# Altium schematic sheet HOL-Nova.SchDoc: Hologram Nova 1.0
size B; Date: 4/19/2017; Revision: J; SheetNumber: 1; SheetTotal: 1
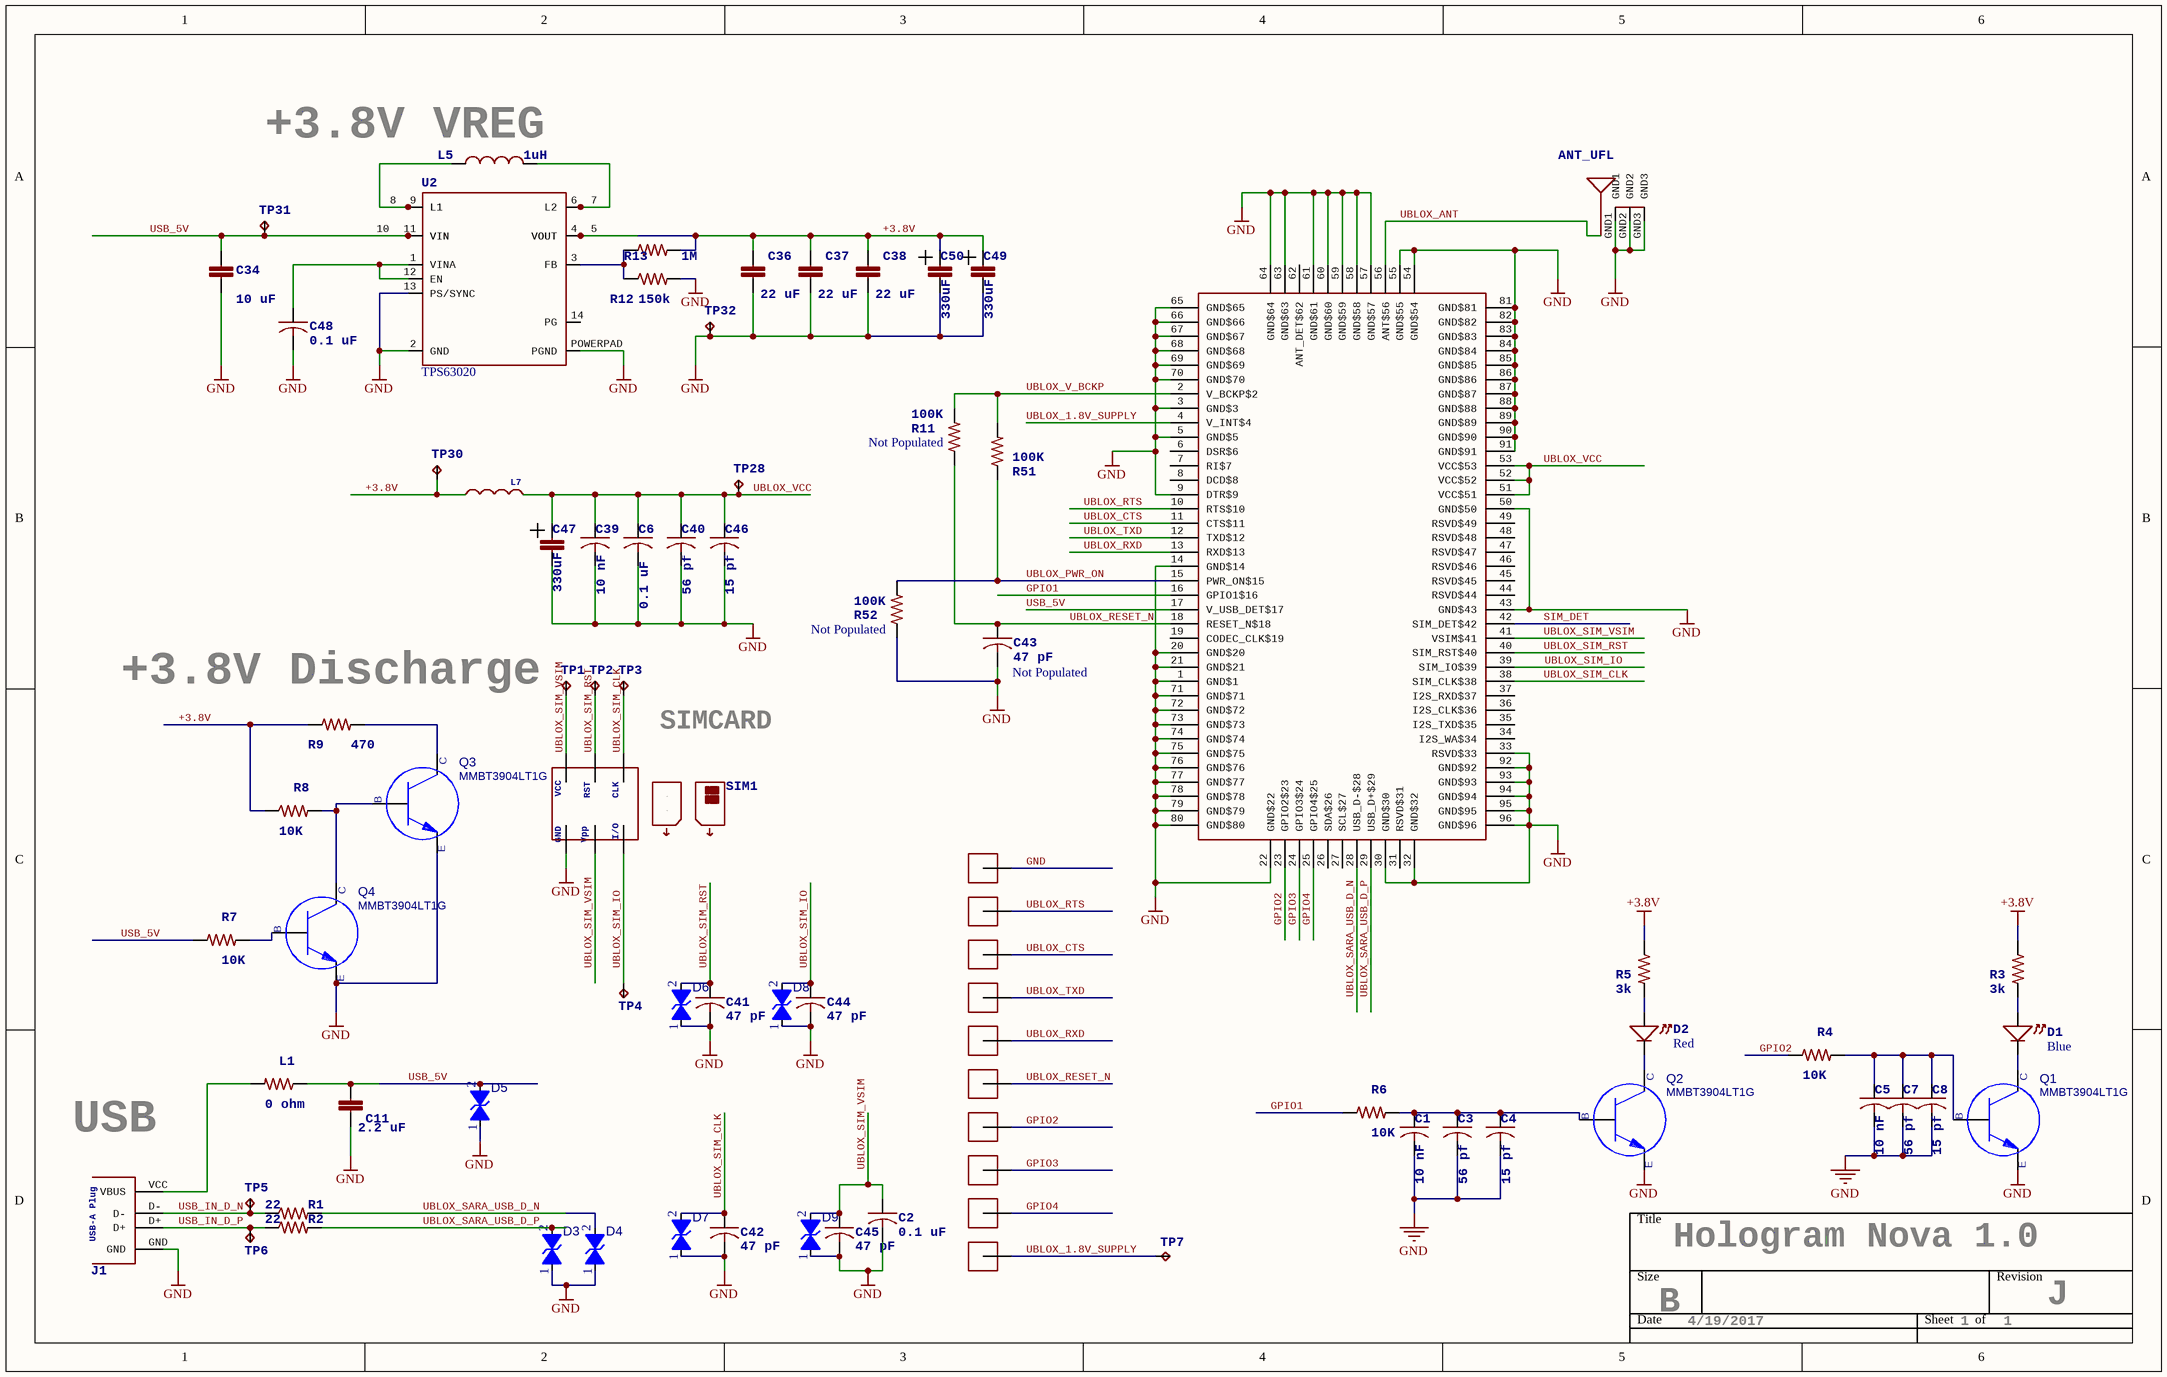
[diagram p0: HOL-Nova.SchDoc]

## Parts
ANT_UFL  ANT-A-1JB  [UFL]  (value not drawn)
C1  10 nF  [CAP0402]
C2  0.1 uF  [CAP0402]
C3  56 pf  [CAP0402]
C4  15 pf  [CAP0402]
C5  10 nF  [CAP0402]
C6  0.1 uF  [CAP0402]
C7  56 pf  [CAP0402]
C8  15 pf  [CAP0402]
C11  2.2 uF  [CAP0603]
C34  10 uF  [CAP0603]
C36  22 uF  [CAP0603]
C37  22 uF  [CAP0603]
C38  22 uF  [CAP0603]
C39  10 nF  [CAP0402]
C40  56 pf  [CAP0402]
C41  47 pF  [CAP0402]
C42  47 pF  [CAP0402]
C43  47 pF  NP: Not Populated  [CAP0402]  (no BOM)
C44  47 pF  [CAP0402]
C45  47 pF  [CAP0402]
C46  15 pf  [CAP0402]
C47  330uF  [CAP1210POL]
C48  0.1 uF  [CAP0402]
C49  330uF  [CAP1210POL]
C50  330uF  [CAP1210POL]
D1  Color: Blue  [LED_0402_VISHAY_VLMB]  (hidden comment: LED_0402_VLMB)
D2  Color: Red  [LED_0402_VISHAY_VLMS]  (hidden comment: LED_0402_VLMS)
D3  (no value)  [PESD_0402]
D4  (no value)  [PESD_0402]
D5  (no value)  [PESD_0402]
D6  (no value)  [PESD_0402]
D7  (no value)  [PESD_0402]
D8  (no value)  [PESD_0402]
D9  (no value)  [PESD_0402]
J1  USB-A: USB-A Plug  [USB_A_PLUG_MOLEX_0480372200 - clipped_copper]  (hidden comment: USB_A_PLUG_MOLEX_0480372200)
L1  0 ohm  [RES0603]
L5  1uH  [COILCRAFT_XFL4020]
L7  FerriteBead 120ohm, 3A  [RES0603]  (value not drawn)
Q1  MPN: MMBT3904LT1G  [SOT23]
Q2  MPN: MMBT3904LT1G  [SOT23]
Q3  MPN: MMBT3904LT1G  [SOT23]
Q4  MPN: MMBT3904LT1G  [SOT23]
R1  22  [RES0402]
R2  22  [RES0402]
R3  3k  [RES0402]
R4  10K  [RES0402]
R5  3k  [RES0402]
R6  10K  [RES0402]
R7  10K  [RES0402]
R8  10K  [RES0402]
R9  470  [RES0402]
R11  100K  NP: Not Populated  [RES0402]  (no BOM)
R12  150k  [RES0402]
R13  1M  [RES0402]
R51  100K  [RES0402]
R52  100K  NP: Not Populated  [RES0402]  (no BOM)
SIM1  SIM_CARD_NANO  [SIM_CARD_NANO]  (value not drawn)
T1  TESTPAD  [TESTPAD]  (value not drawn)  (no BOM)
T2  TESTPAD  [TESTPAD]  (value not drawn)  (no BOM)
T3  TESTPAD  [TESTPAD]  (value not drawn)  (no BOM)
T4  TESTPAD  [TESTPAD]  (value not drawn)  (no BOM)
T5  TESTPAD  [TESTPAD]  (value not drawn)  (no BOM)
T6  TESTPAD  [TESTPAD]  (value not drawn)  (no BOM)
T7  TESTPAD  [TESTPAD]  (value not drawn)  (no BOM)
T8  TESTPAD  [TESTPAD]  (value not drawn)  (no BOM)
T9  TESTPAD  [TESTPAD]  (value not drawn)  (no BOM)
T10  TESTPAD  [TESTPAD]  (value not drawn)  (no BOM)
TP1  TPTP08R  [TP08R]  (value not drawn)  (no BOM)
TP2  TPTP08R  [TP08R]  (value not drawn)  (no BOM)
TP3  TPTP08R  [TP08R]  (value not drawn)  (no BOM)
TP4  TPTP08R  [TP08R]  (value not drawn)  (no BOM)
TP5  TPTP08R  [TP08R]  (value not drawn)  (no BOM)
TP6  TPTP08R  [TP08R]  (value not drawn)  (no BOM)
TP7  TPTP08R  [TP08R]  (value not drawn)  (no BOM)
TP28  TPTP08R  [TP08R]  (value not drawn)  (no BOM)
TP30  TPTP08R  [TP08R]  (value not drawn)  (no BOM)
TP31  TPTP08R  [TP08R]  (value not drawn)  (no BOM)
TP32  TPTP08R  [TP08R]  (value not drawn)  (no BOM)
U2  TPS63020  [QFN-14-POWERPAD3X4DSJ]
U16  SARA-U2XX  [SARA]  (value not drawn)

## Nets
+3.8V: C36.1 C37.1 C38.1 C49.1 C50.1 L7.2(P$2) R3.1 R5.1 R8.1 R9.1 R13.2 TP30.TP U2.4(VOUT) U2.5(VOUT)
GND: ANT_UFL.GND1 ANT_UFL.GND2 ANT_UFL.GND3 C1.2 C2.2 C3.2 C4.2 C5.2 C6.2 C7.2 C8.2 C11.2 C34.2 C36.2 C37.2 C38.2 C39.2 C40.2 C41.2 C42.2 C43.2 C44.2 C45.2 C46.2 C47.2 C48.2 C49.2 C50.2 D3.1 D4.1 D5.1 D6.1 D7.1 D8.1 D9.1 J1.GND Q1.2(E) Q2.2(E) Q3.2(E) Q4.2(E) R12.2 R52.1 SIM1.C5(GND) T10.P$1 TP32.TP U2.2(GND) U2.13(PS/SYNC) U2.POWERPAD(PGND) U16.1(GND$1) U16.3(GND$3) U16.5(GND$5) U16.9(DTR$9) U16.14(GND$14) U16.20(GND$20) U16.21(GND$21) U16.22(GND$22) U16.30(GND$30) U16.32(GND$32) U16.33(RSVD$33) U16.43(GND$43) U16.50(GND$50) U16.54(GND$54) U16.55(GND$55) U16.57(GND$57) U16.58(GND$58) U16.59(GND$59) U16.60(GND$60) U16.61(GND$61) U16.63(GND$63) U16.64(GND$64) U16.65(GND$65) U16.66(GND$66) U16.67(GND$67) U16.68(GND$68) U16.69(GND$69) U16.70(GND$70) U16.71(GND$71) U16.72(GND$72) U16.73(GND$73) U16.74(GND$74) U16.75(GND$75) U16.76(GND$76) U16.77(GND$77) U16.78(GND$78) U16.79(GND$79) U16.80(GND$80) U16.81(GND$81) U16.82(GND$82) U16.83(GND$83) U16.84(GND$84) U16.85(GND$85) U16.86(GND$86) U16.87(GND$87) U16.88(GND$88) U16.89(GND$89) U16.90(GND$90) U16.91(GND$91) U16.92(GND$92) U16.93(GND$93) U16.94(GND$94) U16.95(GND$95) U16.96(GND$96)
GPIO1: R6.1 U16.16(GPIO1$16)
GPIO2: R4.1 T6.P$1 U16.23(GPIO2$23)
GPIO3: T7.P$1 U16.24(GPIO3$24)
GPIO4: T8.P$1 U16.25(GPIO4$25)
SIM_DET: U16.42(SIM_DET$42)
UBLOX_1.8V_SUPPLY: T9.P$1 TP7.TP U16.4(V_INT$4)
UBLOX_ANT: ANT_UFL.SIGNAL U16.56(ANT$56)
UBLOX_CTS: T2.P$1 U16.11(CTS$11)
UBLOX_PWR_ON: R51.1 R52.2 U16.15(PWR_ON$15)
UBLOX_RESET_N: C43.1 R11.1 T5.P$1 U16.18(RESET_N$18)
UBLOX_RTS: T1.P$1 U16.10(RTS$10)
UBLOX_RXD: T4.P$1 U16.13(RXD$13)
UBLOX_SARA_USB_D_N: D4.2 R1.2 U16.28(USB_D-$28)
UBLOX_SARA_USB_D_P: D3.2 R2.2 U16.29(USB_D+$29)
UBLOX_SIM_CLK: C42.1 D7.2 SIM1.C3(CLK) TP3.TP U16.38(SIM_CLK$38)
UBLOX_SIM_IO: C44.1 D8.2 SIM1.C7(IO) TP4.TP U16.39(SIM_IO$39)
UBLOX_SIM_RST: C41.1 D6.2 SIM1.C2(RST) TP2.TP U16.40(SIM_RST$40)
UBLOX_SIM_VSIM: C2.1 C45.1 D9.2 SIM1.C1(VCC) SIM1.C6(VCC2) TP1.TP U16.41(VSIM$41)
UBLOX_TXD: T3.P$1 U16.12(TXD$12)
UBLOX_V_BCKP: R11.2 R51.2 U16.2(V_BCKP$2)
UBLOX_VCC: C6.1 C39.1 C40.1 C46.1 C47.1 L7.1(P$1) TP28.TP U16.51(VCC$51) U16.52(VCC$52) U16.53(VCC$53)
USB_5V: C11.1 C34.1 D5.2 L1.1 R7.1 TP31.TP U2.10(VIN) U2.11(VIN) U16.17(V_USB_DET$17)
USB_IN_D_N: J1.D- R1.1 TP5.TP
USB_IN_D_P: J1.D+ R2.1 TP6.TP
NetC1_1: C1.1 C3.1 C4.1 Q2.1(B) R6.2
NetC5_1: C5.1 C7.1 C8.1 Q1.1(B) R4.2
NetC48_1: C48.1 U2.1(VINA) U2.12(EN)
NetD1_ANODE: D1.ANODE R3.2
NetD1_CATHODE: D1.CATHODE Q1.3(C)
NetD2_ANODE: D2.ANODE R5.2
NetD2_CATHODE: D2.CATHODE Q2.3(C)
NetJ1_VCC: J1.VCC(VBUS) L1.2
NetL5_P$1: L5.P$1 U2.8(L1) U2.9(L1)
NetL5_P$2: L5.P$2 U2.6(L2) U2.7(L2)
NetQ3_1: Q3.1(B) Q4.3(C) R8.2
NetQ3_3: Q3.3(C) R9.2
NetQ4_1: Q4.1(B) R7.2
NetR12_1: R12.1 R13.1 U2.3(FB)

Not connected (* = marked no-connect by the designer): SIM1 MTG1(NC1) MTG2(NC2); U2 14(PG); U16 6(DSR$6) 7(RI$7) 8(DCD$8) 19(CODEC_CLK$19) 26(SDA$26) 27(SCL$27) 31(RSVD$31) 34(I2S_WA$34) 35(I2S_TXD$35) 36(I2S_CLK$36) 37(I2S_RXD$37) 44(RSVD$44) 45(RSVD$45) 46(RSVD$46) 47(RSVD$47) 48(RSVD$48) 49(RSVD$49) 62(ANT_DET$62)

## Notes on the sheet
- (near L5) +3.8V VREG
- (near R9) +3.8V Discharge
- SIMCARD
- (near J1) USB
- Title
- Size
- Date
- B
- Sheet
- of
- Revision

## Library data of the parts
ANT_UFL = ANT-A-1JB: MPN: A-1JB; MFG: Amphenol; Internal PN: CON-0006
C1 C5 C39 = CAP10nF_0402: CAPACITOR, American symbol; MPN: GRM155R71C103KA01D; MFG: MURATA; PKG: 0402; Internal PN: CAP-0016
C2 C6 C48 = CAP0.1uF_0402: CAPACITOR, American symbol; MPN: GRM155R61C104KA88D; MFG: MURATA; PKG: 0402; Internal PN: CAP-0004
C3 C7 C40 = CAP56pF_0402: CAPACITOR, American symbol; MPN: C0402C560J5GACTU; MFG: KEMET; PACKAGE: 0402; Internal PN: CAP-0009
C4 C8 C46 = CAP15pF_0402: CAPACITOR, American symbol; MPN: 04025A150JAT2A; MFG: AVX/ELCO; PACKAGE: 0402; Internal PN: CAP-0011
C11 = CAP2.2uF_0603: Ceramic Capacitor SMD; MPN: CL10A225MQ8NNNC; MFG: SAMSUNG; PACKAGE: 0603; Internal PN: CAP-0002
C34 = CAP10uF_0603: Ceramic Capacitor SMD; MPN: GRM188R60J106ME84D; MFG: Murata; Internal PN: CAP-0007
C36-C38 = CAP22uF_0603: Ceramic Capacitor SMD; MPN: GRM188R60J226MEA0D; MFG: MURATA; PACKAGE: 0603; Internal PN: CAP-0008
C41-C45 = CAP47pf_0402: CAPACITOR, American symbol; MPN: 04025A470JAT2A; MFG: AVX; PKG: 0402; Internal PN: CAP-0010
C47 C49 C50 = CAP330uF_1210P: Capacitor; MPN: F950J337MBAAQ2; MFG: AVX; PACKAGE: 1210; Internal PN: CAP-0012
D1 = LED_0402_VLMB: LED, Vishay Blue 0402; MPN: VLMB1500-GS08; MFG: VISHAY; PACKAGE: 0402; Internal PN: DIO-0007
D2 = LED_0402_VLMS: LED, Vishay Red 0402; MPN: VLMS1500-GS08; MFG: VISHAY; PACKAGE: 0402; Internal PN: DIO-0008
D3-D9 = PESD_14V: DIODE,ZENER VOLTAGE SUPPRESSOR,+/-14V; MPN: PESD0402-140; MFG: Littlefuse; Internal PN: DIO-0009
J1 = USB_A_PLUG_MOLEX_0480372200: Connector, USB A, Plug, 0480372200; MFG: MOLEX; MPN: 0480372200; PACKAGE: CUSTOM; PARTNUM: 0480372200; Internal PN: CON-0008
L1 = RES0R_0603: Resistor, 0 ohm, 0603 case; MPN: RC0603JR-070RL; MFG: YAEGO; PACKAGE: 0603; Internal PN: RES-0020
L5 = INDUCTOR_1UH_XFL4020-102MEC: MFG: Coilcraft; MPN: XFL4020-102MEC; Internal PN: IND-0003
L7 = FerriteBead_120ohm_3A: MPN: BLM18KG121TN1D; MFG: Murata; Internal PN: IND-0005
Q1-Q4 = TSTR_3904_SOT23: TSTR,NPN 3904, SOT23; MFG: ON Semiconductor; Internal PN: IC-0014; Value: *
R1 R2 = RES22R_0402: Resistor, 22 ohm, 0402 case, 1%; MPN: RC0402FR-0722RL; MFG: YAEGO; PACKAGE: 0402; Internal PN: RES-0016
R3 R5 = RES3K_0402: Resistor, 3K ohm, 0402 case, 1%; MPN: RC0402FR-073KL; MFG: YAEGO; PACKAGE: 0402; Internal PN: RES-0019
R4 R6-R8 = RES10K_0402: Resistor, 10k ohm, 0402; MPN: RC0402JR-0710KL; MFG: YAEGO; PACKAGE: 0402; Internal PN: RES-0008
R9 = RES470R_0402: Resistor, 470 ohm, 0402 case, 1%; MPN: ERJ-2GEJ471X; MFG: PANASONIC; PACKAGE: 0402; Internal PN: RES-0006
R11 R51 R52 = RES100K_0402: Resistor, 100k ohm, 0402; MPN: ERJ-2GEJ104X; MFG: PANASONIC; PACKAGE: 0402; Internal PN: RES-0003
R12 = RES150K_0402: Res, 150k ohm, 0402 case, 1%; MPN: RC0402FR-07150KL; MFG: YAEGO; PACKAGE: 0402; Internal PN: RES-0004
R13 = RES1M_0402: Resistor, 1M ohm, 0402 case, 1%; MPN: RC0402FR-071ML; MFG: YAEGO; PACKAGE: 0402; Internal PN: RES-0014
SIM1 = SIM_CARD_NANO: MPN: SIM8050-6-0-14-01-A; MFG: GLOBAL CONNECTOR TECHNOLOGY; PACKAGE: CUSTOM; VCC: VCC; RST: RST; CLK: CLK; I/O: I/O; Vpp: Vpp; GND: GND; Internal PN: CON-0007
TP1-TP7 TP28 TP30-TP32 = TPTP08R: Test pad; MFG: N/A; MPN: N/A
U2 = TPS63020: Regulator, Boost Buck, 3A; MPN: TPS63020DSJ; MFG: TI; Internal PN: IC-0013; PACKAGE: QFN_14_3x4
U16 = SARA-U2XX: MPN: SARA-U260-00S; MFG: U-BLOX; Internal PN: IC-0007